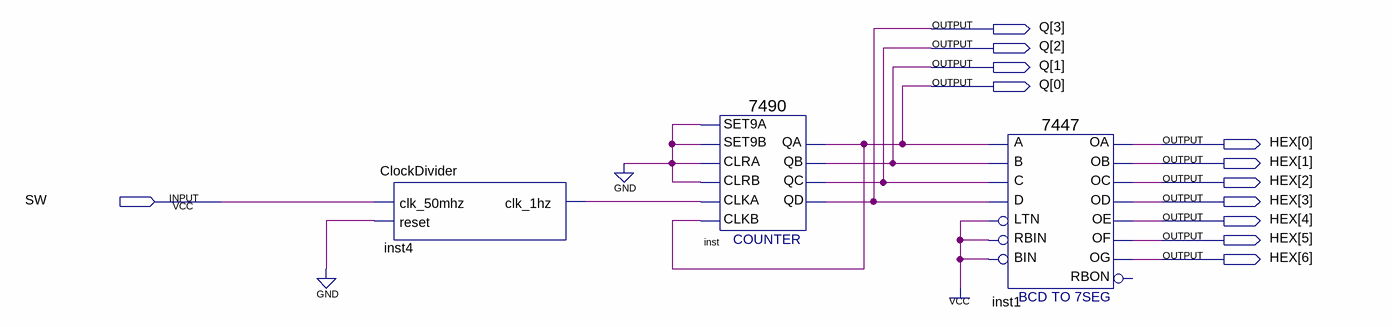
[diagram p0: schematic sheet]
// Quartus schematic bcd2seg.bdf as structural Verilog: 3 symbols, 12 pins
module bcd2seg (
  input  SW,
  output [3:0] Q,
  output [6:0] HEX
);

  wire inst4_clk_1hz;

  ClockDivider inst4 (.clk_50mhz(SW), .reset(1'b0), .clk_1hz(inst4_clk_1hz));
  \7490  inst (
    .SET9A(1'b0), .CLRA(1'b0), .SET9B(1'b0), .CLKB(Q[0]), .CLKA(inst4_clk_1hz), .CLRB(1'b0), .QD(Q[3]),
    .QA(Q[0]), .QB(Q[1]), .QC(Q[2]));
  \7447  inst1 (
    .LTN(1'b1), .B(Q[1]), .C(Q[2]), .D(Q[3]), .RBIN(1'b1), .BIN(1'b1), .A(Q[0]), .OB(HEX[1]), .OC(HEX[2]),
    .OE(HEX[4]), .OD(HEX[3]), .OF(HEX[5]), .OG(HEX[6]), .OA(HEX[0]));  // open: RBON
endmodule
